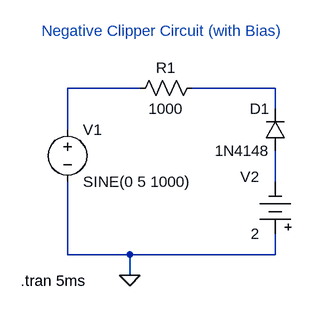
[diagram p0: schematic Assignment 1b (ii).asc]
Assignment 1b (ii).asc, the LTspice schematic file:
Version 4.1
SHEET 1 880 680
WIRE 192 80 80 80
WIRE 400 80 272 80
WIRE 400 112 400 80
WIRE 80 144 80 80
WIRE 400 224 400 176
WIRE 80 336 80 224
WIRE 176 336 80 336
WIRE 400 336 400 304
WIRE 400 336 176 336
WIRE 176 368 176 336
FLAG 176 368 0
SYMBOL voltage 80 128 R0
WINDOW 123 0 0 Left 0
WINDOW 39 0 0 Left 0
SYMATTR InstName V1
SYMATTR Value SINE(0 5 1000)
SYMBOL res 288 64 R90
WINDOW 0 0 56 VBottom 2
WINDOW 3 32 56 VTop 2
SYMATTR InstName R1
SYMATTR Value 1000
SYMBOL diode 416 176 R180
WINDOW 0 24 64 Left 2
WINDOW 3 24 0 Left 2
SYMATTR InstName D1
SYMATTR Value 1N4148
SYMBOL Misc\\battery 400 320 R180
WINDOW 0 24 104 Left 2
WINDOW 3 24 16 Left 2
WINDOW 123 0 0 Left 0
WINDOW 39 0 0 Left 0
SYMATTR InstName V2
SYMATTR Value 2
TEXT 8 376 Left 2 !.tran 5ms
TEXT 40 -8 Left 2 ;Negative Clipper Circuit (with Bias)

The netlist it stands for:
* Assignment 1b (ii).asc
V1 N001 0 SINE(0 5 1000)
R1 N002 N001 1000
D1 N003 N002 1N4148
V2 0 N003 2
.model D D
.lib standard.dio
.tran 5ms
* Negative Clipper Circuit (with Bias)
.backanno
.end